# EAGLE design RH_T_SENSOR (EAGLE 9.6.2)
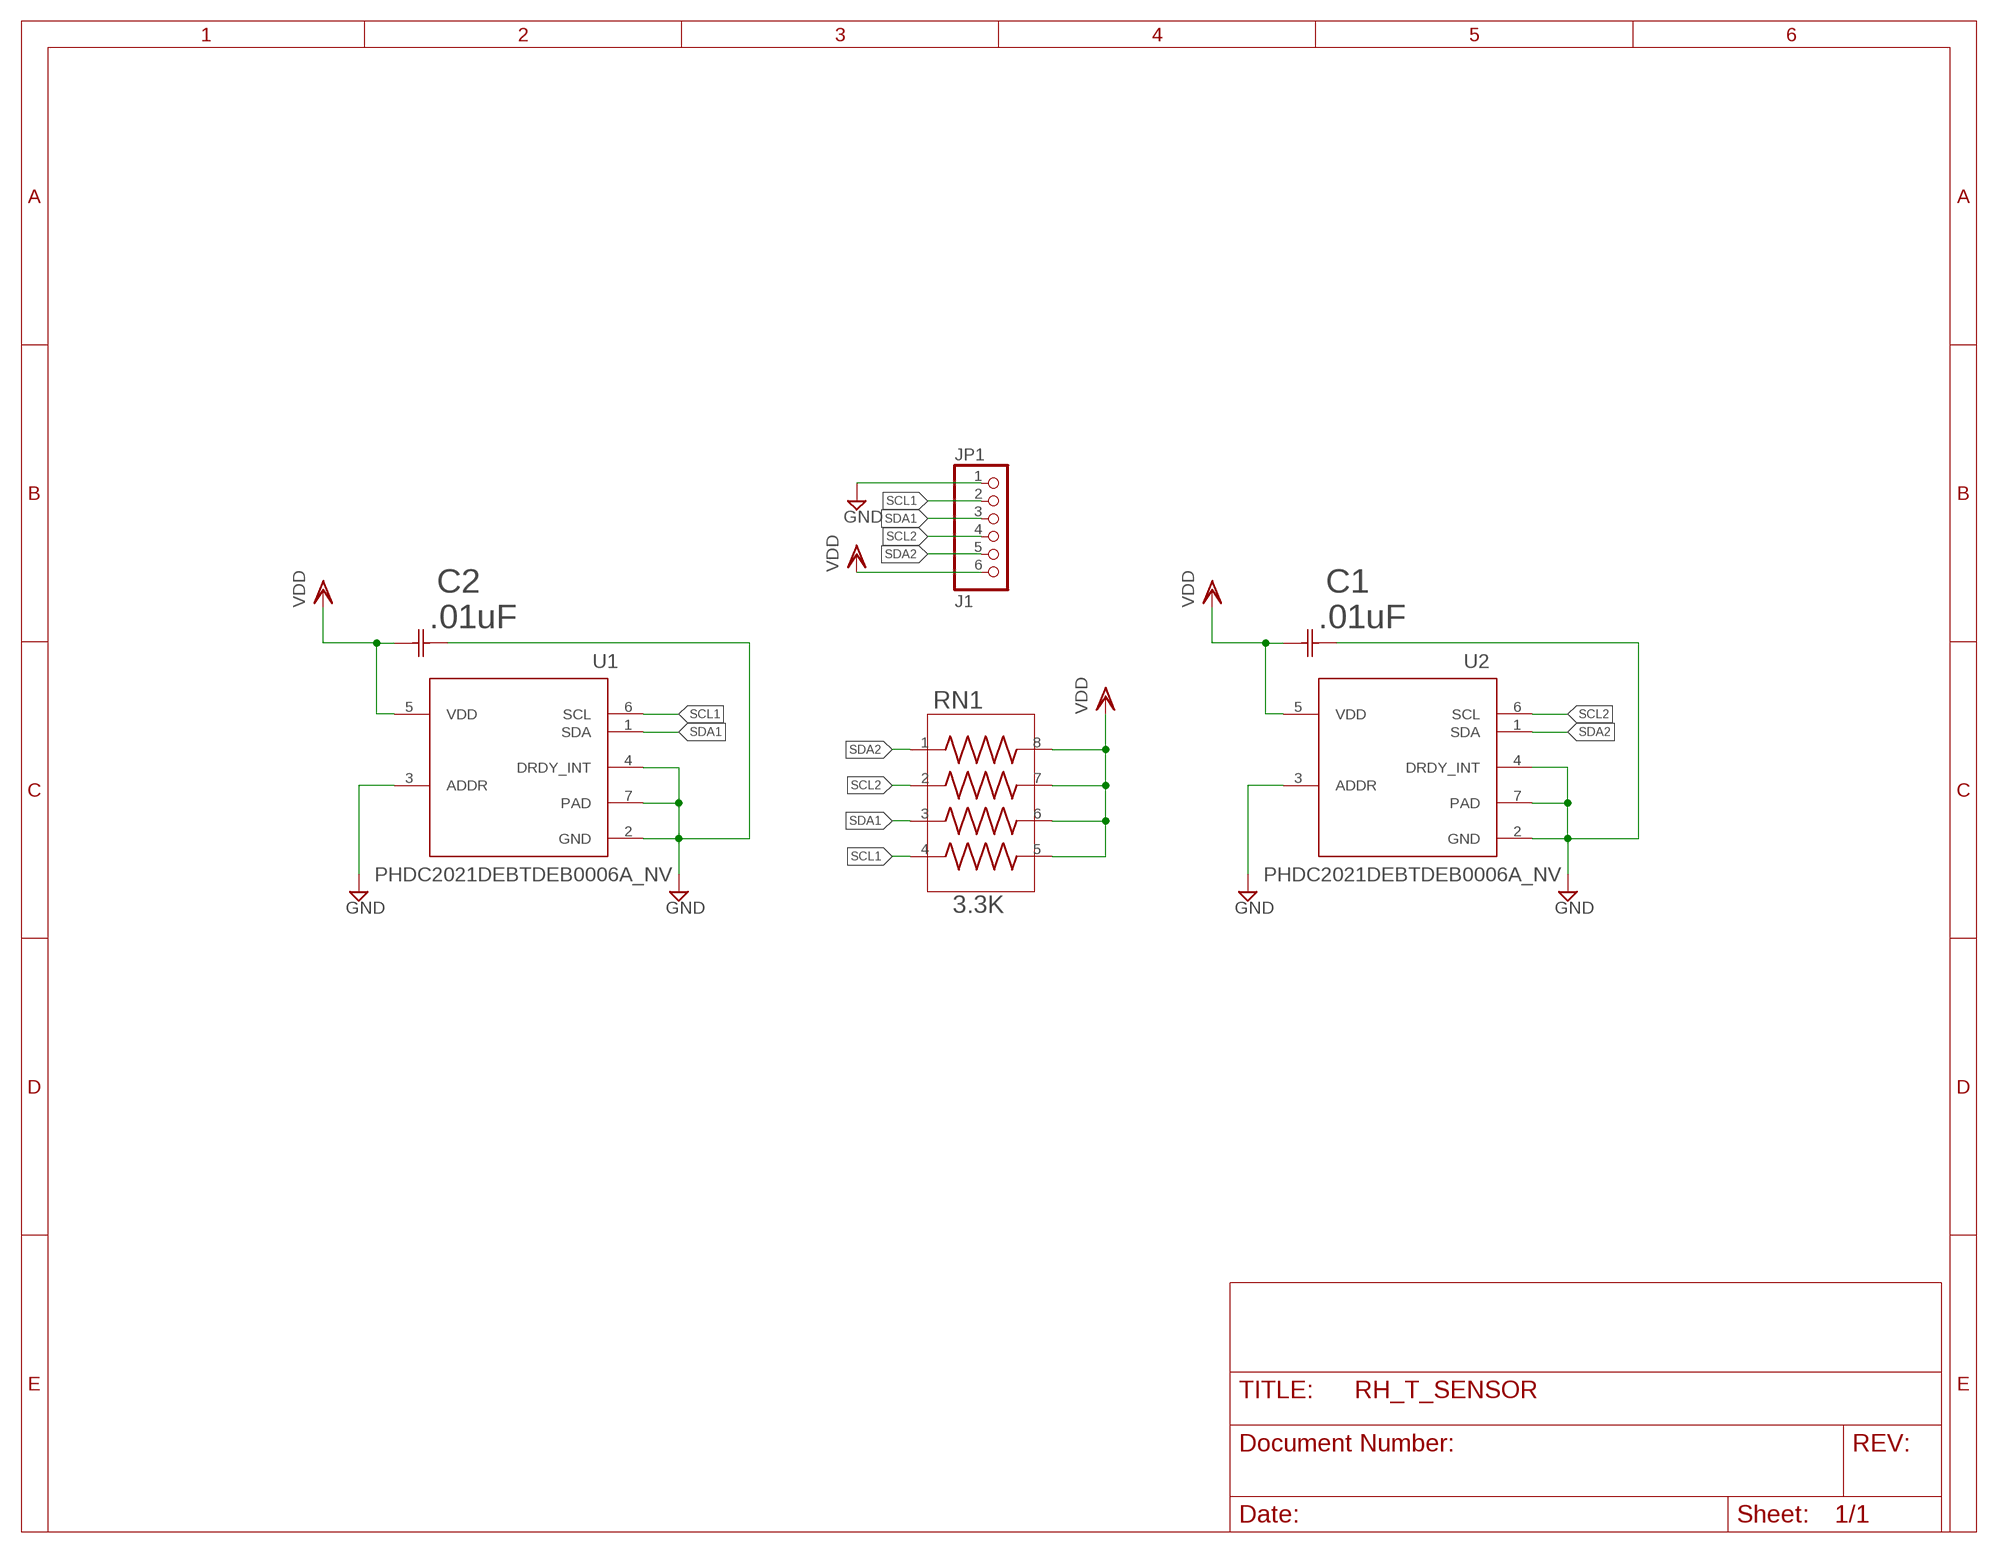
[diagram p0: schematic, sheet 1]

## Parts
C1  .01uF  0402YC104KAT2A0402_AVX  [0402_AVX]
C2  .01uF  0402YC104KAT2A0402_AVX  [0402_AVX]
JP1  J1  PINHD-1X6M  [1X06M]
RN1  3.3K  CAY16-332J4LF  [RESCAF80P320X160X60-8N]
U1  PHDC2021DEBTDEB0006A_NV  [DEB0006A_NV]
U2  PHDC2021DEBTDEB0006A_NV  [DEB0006A_NV]

## Nets
GND: C1.2 C2.2 JP1.1 U1.2(GND) U1.3(ADDR) U1.4(DRDY_INT) U1.7(PAD) U2.2(GND) U2.3(ADDR) U2.4(DRDY_INT) U2.7(PAD)
SCL1: JP1.2 RN1.4 U1.6(SCL)
SCL2: JP1.4 RN1.2 U2.6(SCL)
SDA1: JP1.3 RN1.3 U1.1(SDA)
SDA2: JP1.5 RN1.1 U2.1(SDA)
VDD: C1.1 C2.1 JP1.6 RN1.5 RN1.6 RN1.7 RN1.8 U1.5(VDD) U2.5(VDD)

## Library data of the parts
C1 C2 = 2023-06-30_23-55-05_Library:0402YC104KAT2A; COPYRIGHT: Copyright (C) 2023 Ultra Librarian. All rights reserved.; MANUFACTURER_PART_NUMBER: 0402YC104KAT2A; MFR_NAME: KYOCERA AVX
JP1 = pinhead:PINHD-1X6: PIN HEADER
RN1 = CAY16-332J4LF:CAY16-332J4LF: Res Thick Film Array 75 Ohm 5% 0.25W(1/4W) ?200ppm/C ISOL Molded 8-Pin 1206(4 X 0603) Convex SMD T/R; MANUFACTURER: Bourns; STANDARD: IPC-7351B
U1 U2 = untitled:PHDC2021DEBT; COPYRIGHT: Copyright (C) 2023 Ultra Librarian. All rights reserved.; MANUFACTURER_PART_NUMBER: PHDC2021DEBT; MFR_NAME: Texas Instruments; REFDES: RefDes; TYPE: TYPE

## Board
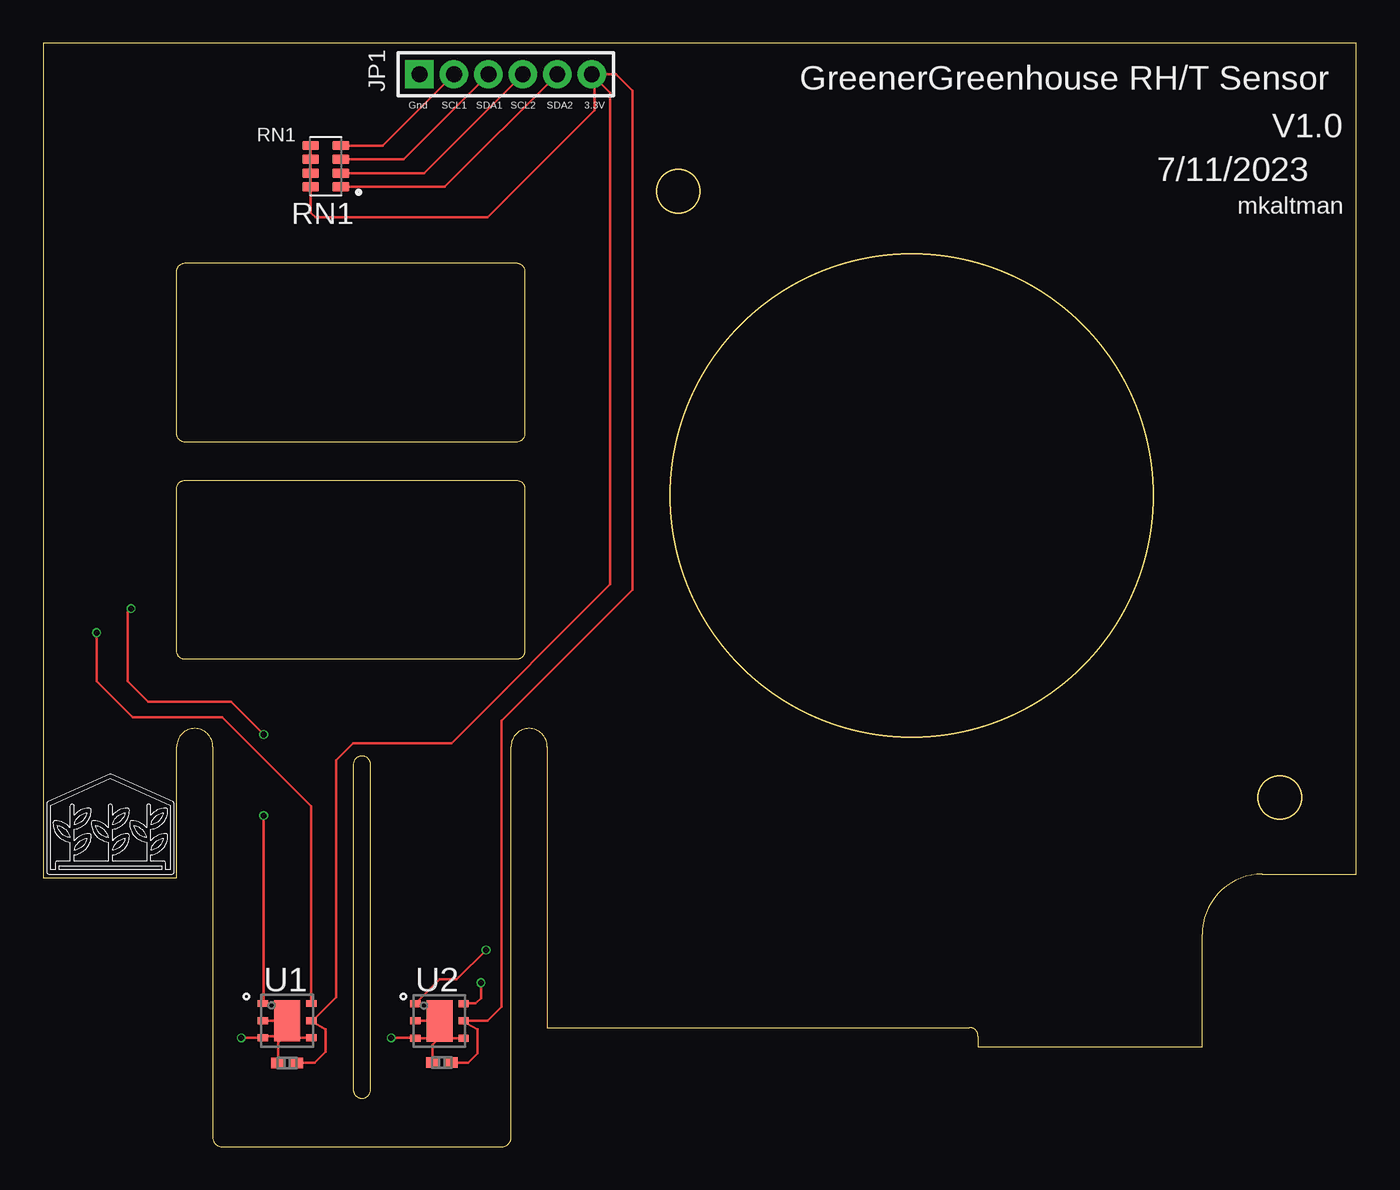
[diagram p1: board, top side]
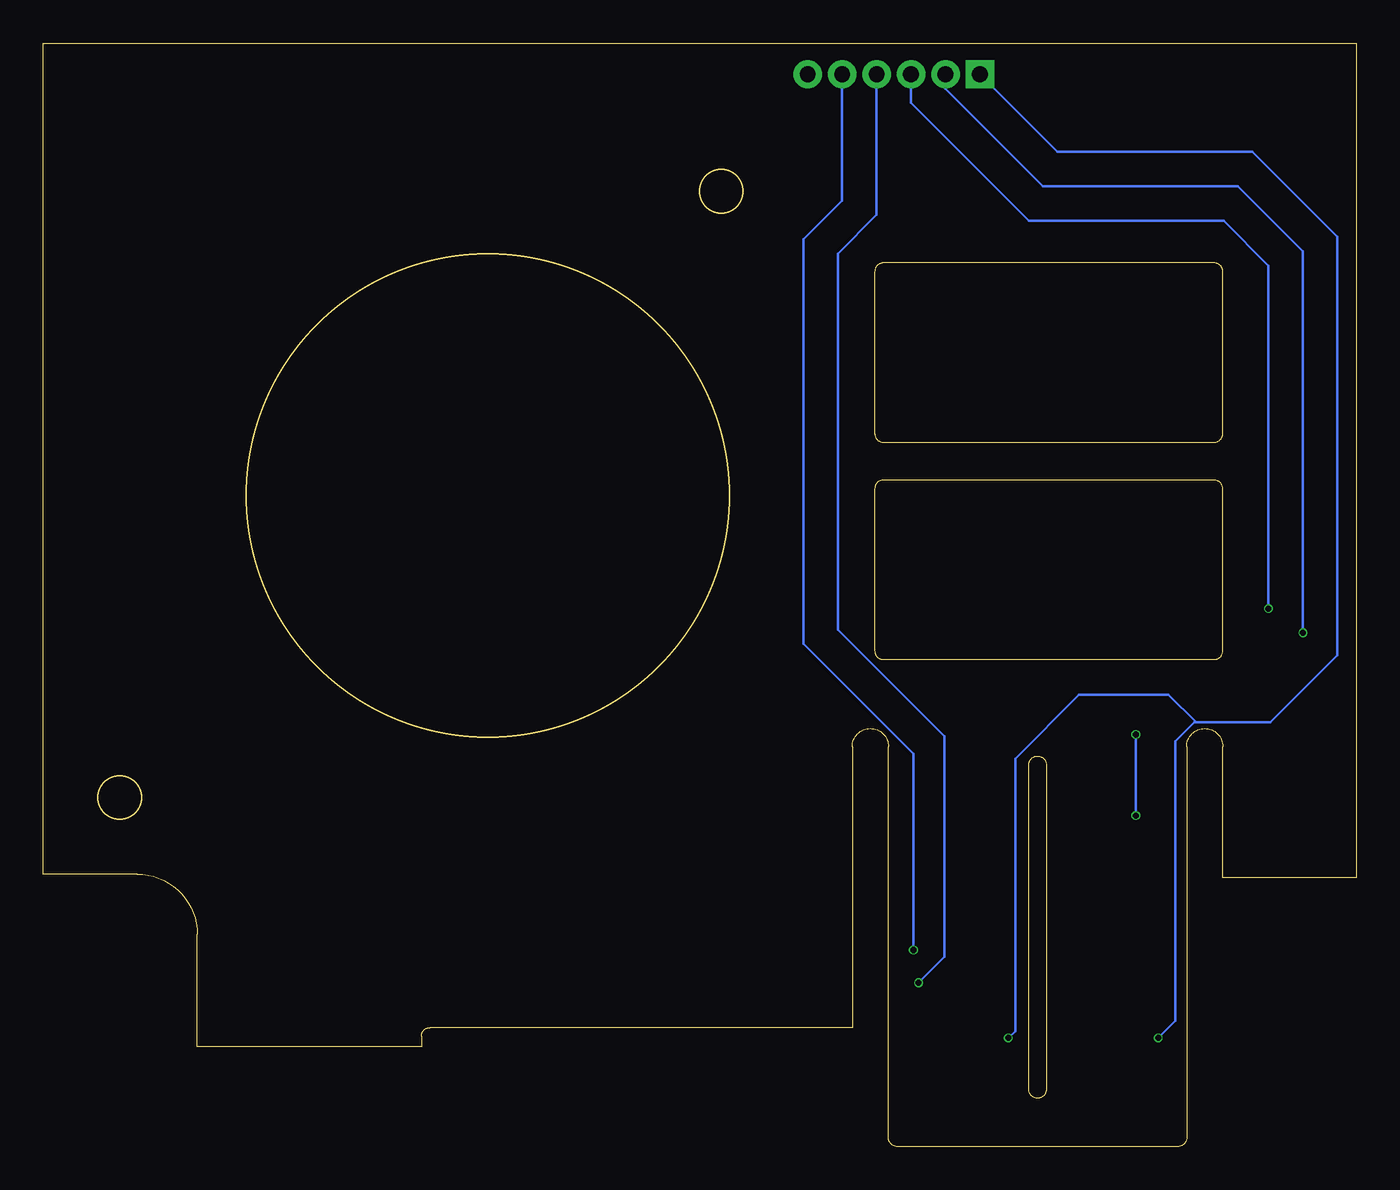
[diagram p2: board, bottom side, seen from below]

Size 76.2 x 64 mm. Coordinates in mm from the lower left corner, seen from the top.
Outline: 26.65,0 arc90 27.15,0.5 27.15,23.2 arc-180 29.25,23.2 29.25,6.9 53.75,6.9 arc-90 54.25,6.4 54.25,5.8 67.25,5.8 67.25,12.3 arc-90 70.75,15.8 76.2,15.8 76.2,64 0,64 0,15.6 7.75,15.6 7.75,23.2 arc-180 9.85,23.2 9.85,0.5 arc90 10.35,0 26.65,0
Outline: 7.75,28.75 7.75,38.15 arc-90 8.25,38.65 27.45,38.65 arc-90 27.95,38.15 27.95,28.75 arc-90 27.45,28.25 8.25,28.25 arc-90 7.75,28.75
Outline: 7.75,41.35 7.75,50.75 arc-90 8.25,51.25 27.45,51.25 arc-90 27.95,50.75 27.95,41.35 arc-90 27.45,40.85 8.25,40.85 arc-90 7.75,41.35
Outline: 18,3.3 arc180 19,3.3 19,22.15 arc180 18,22.15 18,3.3
Outline: circle at 50.4,37.75 radius 14
Outline: circle at 71.75,20.25 radius 1.25
Outline: circle at 36.85,55.4 radius 1.25
Copper layers (1*16): Top 0.035mm / dielectric 1.6mm / Bottom 0.035mm
Design rules "jlcpcb-2layers": minimum track width 5mil, minimum drill 0.3mm, track to track 5mil, track to pad 5mil, pad to pad 5mil, via to via 5mil, smd to smd 5mil, copper to edge 0.2mm, drill to drill 6mil, minimum pad ring 10mil, minimum via ring 3mil, stop-mask expansion 4mil, vias tented up to drill 0mil, thermal gap 10mil

### Footprints (pad centres in the part's own frame; a part is rotated, then mirrored left to right if it is on the bottom)
0402_AVX = smd 0.762 x 0.61: 1 -0.533,0; 2 0.533,0
1X06M = drill 0.914 square: 1 -5,0 | drill 0.914: 2 -3,0; 3 -1,0; 4 1,0; 5 3,0; 6 5,0
RESCAF80P320X160X60-8N = smd 0.97 x 0.53: 1 -0.875,1.2; 2 -0.875,0.4; 3 -0.875,-0.4; 4 -0.875,-1.2; 5 0.875,-1.2; 6 0.875,-0.4; 7 0.875,0.4; 8 0.875,1.2
DEB0006A_NV = smd 0.6 x 0.4: 1 -1.4,1; 2 -1.4,0; 3 -1.4,-1; 4 1.4,-1; 5 1.4,0; 6 1.4,1 | smd 1.5 x 2.4: 7 0,0

### Placement (x,y rotation side)
C1  23.14,4.87 180 top
C2  14.16,4.85 180 top
JP1  26.84,62.19 0 top
RN1  16.4,56.86 180 top
U1  14.16,7.3 0 top
U2  23,7.29 0 top

### Tracks (layer width: path | path; a pad name or v marks a point on that pad's centre or on a via)
GND  (via drill 0.35)
  Top 0.127: 23.1,6.3
  Top 0.152: U1.2 14.1,7.3 | U1.7 14.1,7.36 14.1,7.3 | 14,6.7 13.7,6.4 12.86,6.4 U1.3 v11.5,6.3 | 14,6.7 14.1,6.8 14.1,7.3 | U1.4 14.4,6.3 14.15,6.55 | 14.15,6.55 14,6.7 | v20.2,6.3 U2.3 23,6.29 | 23,6.29 23.09,6.29 23.1,6.3 23.11,6.29 U2.4 | U2.2 U2.7 | U2.7 23.1,7.19 23.1,6.4 | 23.1,6.4 23.1,6.3 | C2.2 13.63,6.03 14.15,6.55 | C1.2 22.61,5.91 23.1,6.4 | U2.7 23,6.29
  Bottom 0.152: 9.3,24.6 5,24.6 1.1,28.5 1.1,52.76 6.04,57.7 17.35,57.7 JP1.1 | 9.3,24.6 9.4,24.6 10.5,23.5 10.5,7.3 v11.5,6.3 | v20.2,6.3 19.8,6.7 19.8,22.5 16.1,26.2 10.9,26.2 9.3,24.6
SCL1  (via drill 0.35)
  Top 0.152: v3.1,29.8 3.1,27 5.2,24.9 10.4,24.9 15.56,19.74 U1.6 | RN1.4 19.71,58.06 JP1.2
  Bottom 0.152: JP1.2 23.84,61.36 18.18,55.7 6.87,55.7 3.1,51.93 v3.1,29.8
SCL2  (via drill 0.35)
  Top 0.152: U2.6 25.1,8.3 25.4,8.6 v25.4,9.5 | RN1.2 22.11,56.46 JP1.4
  Bottom 0.152: JP1.4 27.84,54.03 30.09,51.79 30.09,29.99 23.9,23.8 23.9,11 v25.4,9.5
SDA1  (via drill 0.35)
  Top 0.152: v5.1,31.2 4.9,31 4.9,27 6.1,25.8 10.9,25.8 v12.8,23.9 | v12.8,19.2 12.8,8.34 U1.1 | RN1.3 20.91,57.26 JP1.3
  Bottom 0.152: v12.8,23.9 v12.8,19.2 | JP1.3 25.84,60.53 19.01,53.7 7.7,53.7 5.1,51.1 v5.1,31.2
SDA2  (via drill 0.35)
  Top 0.152: v25.7,11.4 24,9.7 23,9.7 U2.1 | JP1.5 23.31,55.66 RN1.1
  Bottom 0.152: v25.7,11.4 25.7,11.77 25.71,11.79 25.71,22.79 32.09,29.16 32.09,52.61 29.84,54.86 JP1.5
VDD
  Top 0.127: 16.4,6.8 15.62,7.26 U1.5 | 25.2,6.81 24.5,7.19 U2.5
  Top 0.152: RN1.5 RN1.6 RN1.7 RN1.8 15.52,54.18 15.8,53.9 25.8,53.9 32,60.1 32,62.03 JP1.6 | JP1.6 33.24,62.19 34.2,61.23 34.2,32.3 26.6,24.7 26.6,8.1 25.79,7.29 U2.5 | JP1.6 32.9,61.13 32.9,32.6 23.7,23.4 18,23.4 17,22.4 17,8.65 15.62,7.26 | 16.4,6.8 16.4,5.5 15.75,4.85 C2.1 | 25.2,6.81 25.2,5.4 24.67,4.87 C1.1

### Text on the board
tPlace: GreenerGreenhouse RH/T Sensor | Gnd | SCL1 | SDA1 | SCL2 | SDA2 | 3.3V | RN1 | V1.0 | 7/11/2023 | mkaltman | U1 | U2